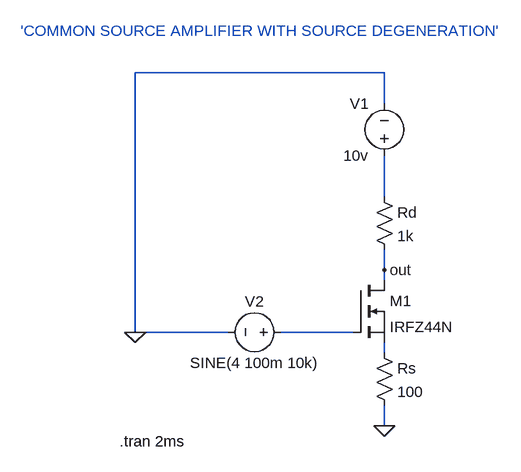
[diagram p0: schematic 10.Common Source Amplifier.asc]
10.Common Source Amplifier.asc, the LTspice schematic file:
Version 4
SHEET 1 880 680
WIRE 256 -208 -128 -208
WIRE 256 -160 256 -208
WIRE 256 -16 256 -80
WIRE 256 96 256 64
WIRE 256 112 256 96
WIRE -128 192 -128 -208
WIRE 16 192 -128 192
WIRE 208 192 96 192
WIRE 256 224 256 208
WIRE 256 336 256 304
FLAG 256 336 0
FLAG -128 192 0
FLAG 256 96 out
SYMBOL nmos 208 112 R0
SYMATTR InstName M1
SYMATTR Value IRFZ44N
SYMBOL res 240 208 R0
SYMATTR InstName Rs
SYMATTR Value 100
SYMBOL res 240 -32 R0
SYMATTR InstName Rd
SYMATTR Value 1k
SYMBOL voltage 256 -64 R180
WINDOW 0 24 96 Left 2
WINDOW 3 24 16 Left 2
WINDOW 123 0 0 Left 0
WINDOW 39 0 0 Left 0
SYMATTR InstName V1
SYMATTR Value 10v
SYMBOL voltage 112 192 R90
WINDOW 0 -32 56 VBottom 2
WINDOW 3 32 56 VTop 2
WINDOW 123 60 56 VTop 2
WINDOW 39 0 0 Left 0
SYMATTR InstName V2
SYMATTR Value SINE(4 100m 10k)
TEXT -152 360 Left 2 !.tran 2ms
TEXT -304 -272 Left 2 ;'COMMON SOURCE AMPLIFIER WITH SOURCE DEGENERATION'

The netlist it stands for:
* 10.Common Source Amplifier.asc
M1 out N002 N003 N003 IRFZ44N
Rs N003 0 100
Rd N001 out 1k
V1 N001 0 10v
V2 N002 0 SINE(4 100m 10k)
.model NMOS NMOS
.model PMOS PMOS
.lib standard.mos
.tran 2ms
* 'COMMON SOURCE AMPLIFIER WITH SOURCE DEGENERATION'
.backanno
.end